# EAGLE design arduino-pro-mini_2-way-switches_v0.2.5_Squeezing (EAGLE 7.2.0)
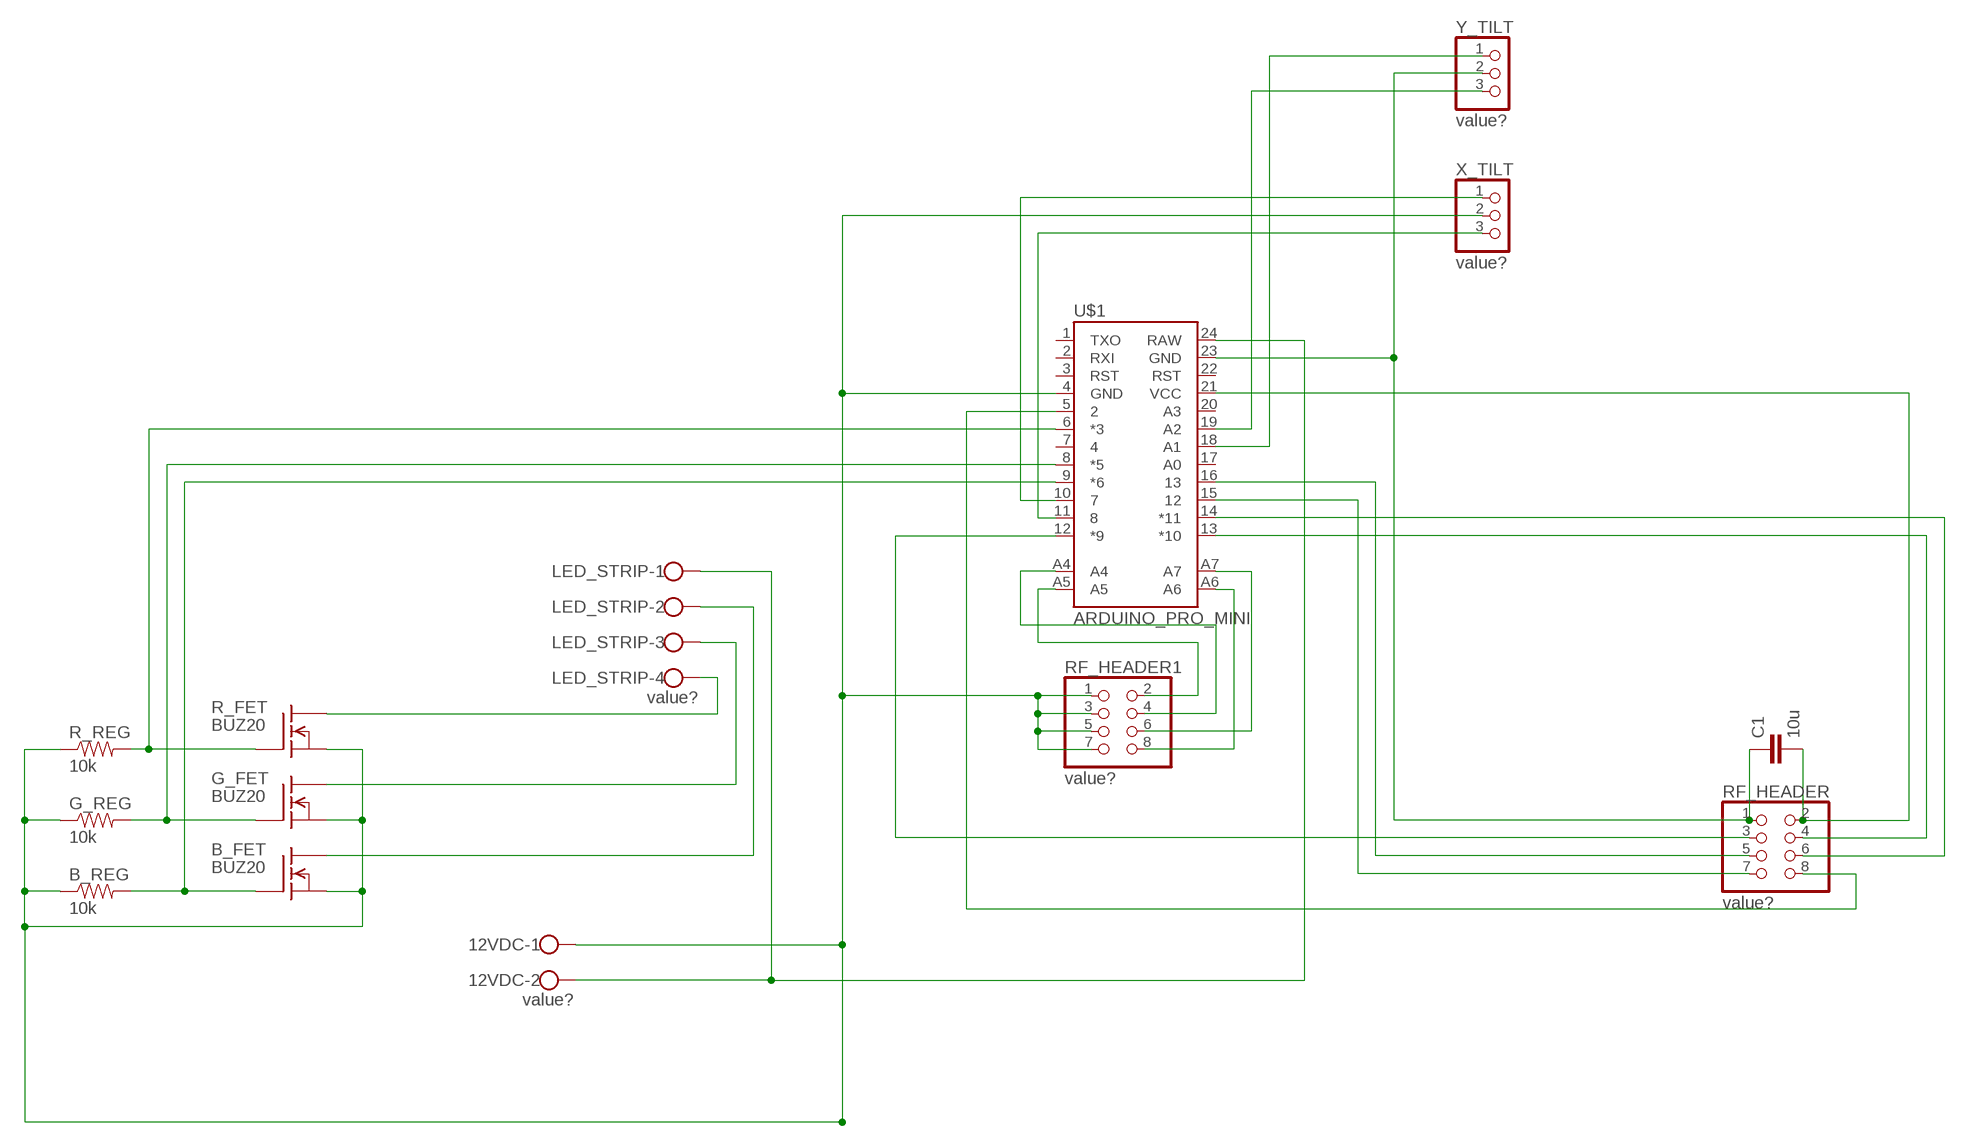
[diagram p0: schematic, sheet 1]

## Parts
12VDC  value?  W237-102  [W237-102]
B_FET  BUZ20  [TO220]
B_REG  10k  RESISTORPTH-1/4W  [AXIAL-0.4]
C1  10u  CAPPTH  [CAP-PTH-SMALL]
G_FET  BUZ20  [TO220]
G_REG  10k  RESISTORPTH-1/4W  [AXIAL-0.4]
LED_STRIP  value?  W237-4  [W237-4]
R_FET  BUZ20  [TO220]
R_REG  10k  RESISTORPTH-1/4W  [AXIAL-0.4]
RF_HEADER  value?  PINHD-2X4  [2X04]
RF_HEADER1  value?  PINHD-2X4  [2X04]
U$1  ARDUINO_PRO_MINI  [ARDUINO_PRO_MINI]
X_TILT  value?  PINHD-1X3  [1X03]
Y_TILT  value?  PINHD-1X3  [1X03]

## Nets
N$1: U$1.10 X_TILT.1
N$2: B_FET.1(G) B_REG.P$2 U$1.9(*6)
N$3: R_FET.1(G) R_REG.P$2 U$1.6(*3)
N$4: G_FET.2(D) LED_STRIP.3
N$5: B_FET.2(D) LED_STRIP.2
N$6: U$1.11 X_TILT.3
N$7: LED_STRIP.4 R_FET.2(D)
N$9: 12VDC.2 LED_STRIP.1 U$1.24(RAW)
N$10: C1.1 RF_HEADER.1 U$1.23(GND) Y_TILT.2
N$11: 12VDC.1 B_FET.3(S) B_REG.P$1 G_FET.3(S) G_REG.P$1 R_FET.3(S) R_REG.P$1 RF_HEADER1.1 RF_HEADER1.3 RF_HEADER1.5 RF_HEADER1.7 U$1.4(GND) X_TILT.2
N$12: RF_HEADER1.4 U$1.A4
N$13: G_FET.1(G) G_REG.P$2 U$1.8(*5)
N$14: U$1.19(A2) Y_TILT.3
N$15: RF_HEADER.3 U$1.12(*9)
N$16: RF_HEADER.4 U$1.13(*10)
N$17: RF_HEADER.6 U$1.14(*11)
N$18: RF_HEADER1.2 U$1.A5
N$19: RF_HEADER1.8 U$1.A6
N$20: RF_HEADER1.6 U$1.A7
N$21: RF_HEADER.7 U$1.15
N$23: RF_HEADER.5 U$1.16
N$25: RF_HEADER.8 U$1.5
N$27: U$1.18(A1) Y_TILT.1
Y_TILT: C1.2 RF_HEADER.2 U$1.21(VCC)
Unconnected: U$1.1(TXO) U$1.2(RXI) U$1.3(RST) U$1.7 U$1.17(A0) U$1.20(A3) U$1.22(RST)

## Library data of the parts
12VDC = con-wago-500:W237-102: WAGO SCREW CLAMP; MPN: 237-102; OC_FARNELL: unknown; OC_NEWARK: 70K9898
B_FET G_FET R_FET = transistor-fet:BUZ20: N-Channel Enhancement MOSFET 100V; 12A; 0,2Ohm
B_REG G_REG R_REG = SparkFun-Passives:RESISTOR: Resistor Basic schematic elements and footprints for 0603, 1206, and PTH resistors.
C1 = SparkFun-Passives:CAP: Capacitor Standard 0603 ceramic capacitor, and 0.1" leaded capacitor.
LED_STRIP = con-wago-500:W237-4: WAGO SCREW CLAMP; OC_FARNELL: unknown; OC_NEWARK: unknown
RF_HEADER RF_HEADER1 = rf-header:PINHD-2X4: PIN HEADER
U$1 = SparkFun-Boards:ARDUINO_PRO_MINI
X_TILT Y_TILT = pinhead:PINHD-1X3: PIN HEADER

## Board
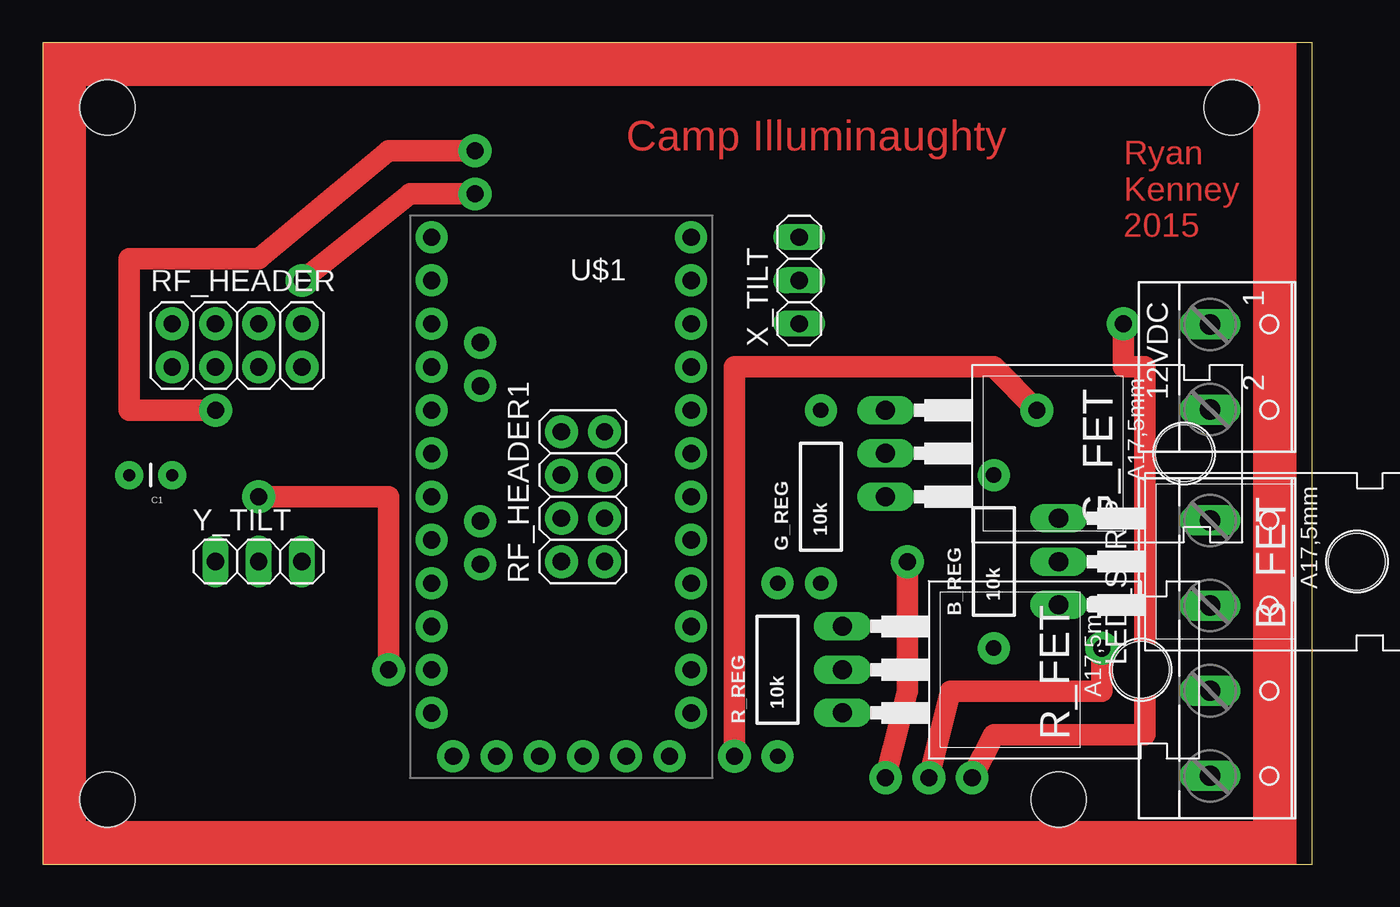
[diagram p1: board, top side]
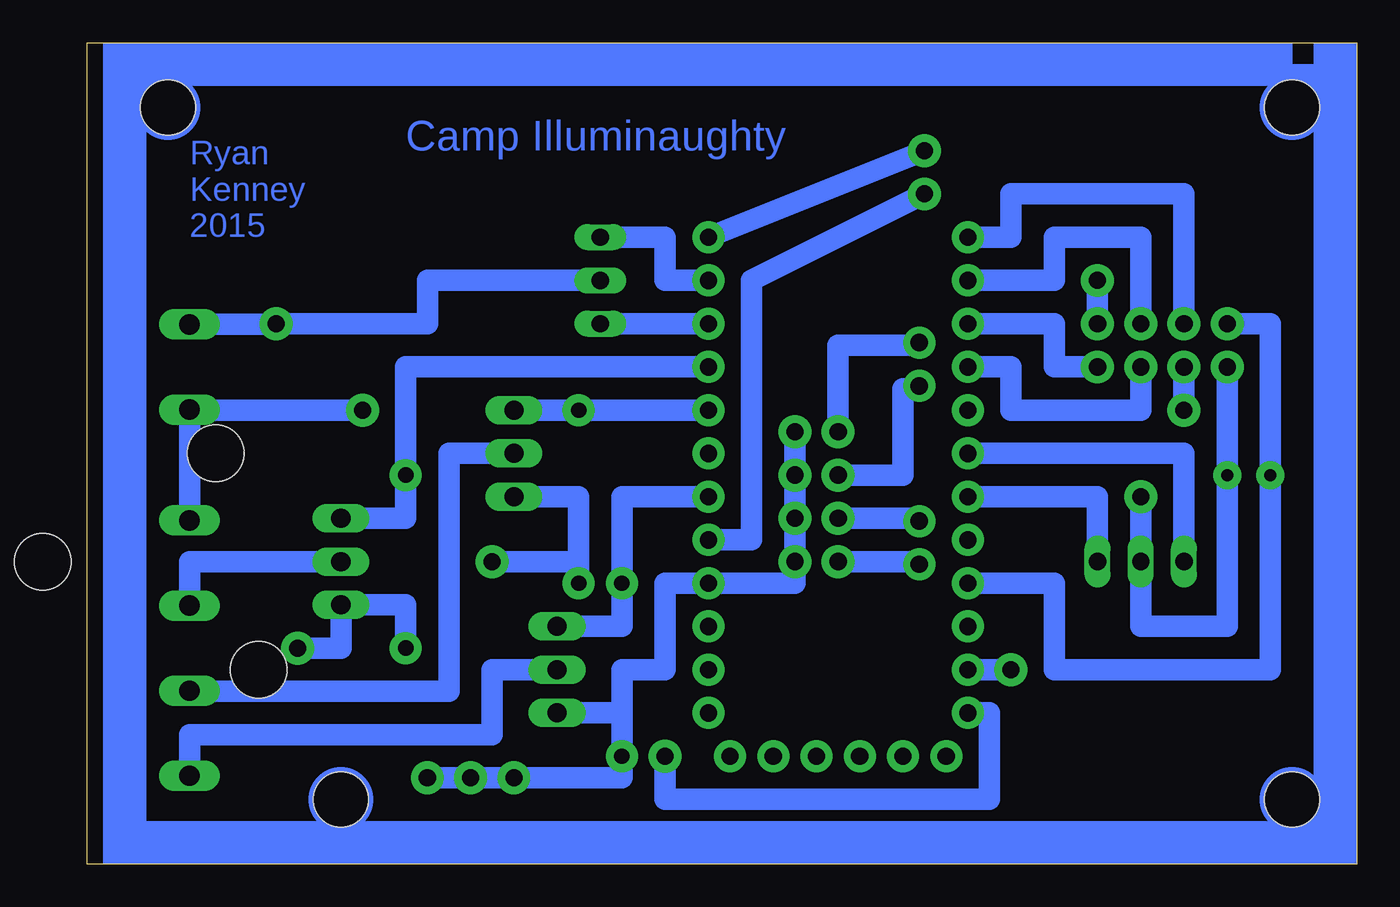
[diagram p2: board, bottom side, seen from below]

Size 74.6 x 48.25 mm. Coordinates in mm from the lower left corner, seen from the top.
Outline: 0,0 74.6,0 74.6,48.25 0,48.25 0,0
Copper layers (1*16): Top 0.035mm / dielectric 1.5mm / Bottom 0.035mm
Design rules "default": minimum track width 10mil, minimum drill 24mil, track to track 8mil, track to pad 8mil, pad to pad 8mil, via to via 8mil, smd to smd 8mil, copper to edge 40mil, drill to drill 8mil, minimum pad ring 10mil, minimum via ring 8mil, stop-mask expansion 4mil, vias tented up to drill 0mil, thermal gap 10mil
Holes 3.2 mm at 3.81,44.45 3.81,3.81 69.85,44.45 59.69,3.81

### Footprints (pad centres in the part's own frame; a part is rotated, then mirrored left to right if it is on the bottom)
W237-102 = drill 1.194 long: 1 -2.5,-1.27; 2 2.5,-1.27
TO220 = drill 1.118 long: 1 -2.54,-6.35; 2 0,-6.35; 3 2.54,-6.35 | hole 3.302: 0,11.176
AXIAL-0.4 = drill 0.9 pad 1.88: P$1 -5.08,0; P$2 5.08,0
CAP-PTH-SMALL = drill 0.7 pad 1.651: 1 0,0; 2 2.54,0
W237-4 = drill 1.194 long: 1 -7.5,-1.27; 2 -2.5,-1.27; 3 2.5,-1.27; 4 7.5,-1.27
2X04 = drill 1.016 pad 1.93: 1 -3.81,-1.27; 2 -3.81,1.27; 3 -1.27,-1.27; 4 -1.27,1.27; 5 1.27,-1.27; 6 1.27,1.27; 7 3.81,-1.27; 8 3.81,1.27
ARDUINO_PRO_MINI = drill 1.016 pad 1.88: 1 -7.62,12.7; 2 -7.62,10.16; 3 -7.62,7.62; 4 -7.62,5.08; 5 -7.62,2.54; 6 -7.62,0; 7 -7.62,-2.54; 8 -7.62,-5.08; 9 -7.62,-7.62; 10 -7.62,-10.16; 11 -7.62,-12.7; 12 -7.62,-15.24; 13 7.62,-15.24; 14 7.62,-12.7; 15 7.62,-10.16; 16 7.62,-7.62; 17 7.62,-5.08; 18 7.62,-2.54; 19 7.62,0; 20 7.62,2.54; 21 7.62,5.08; 22 7.62,7.62; 23 7.62,10.16; 24 7.62,12.7; A4 4.763,1.429; A5 4.763,3.969; A6 4.763,-9.049; A7 4.763,-6.509; BLK -6.35,15.24; GND -3.81,15.24; GRN 6.35,15.24; RXI 1.27,15.24; TXO 3.81,15.24; VCC -1.27,15.24
1X03 = drill 1.016 long: 1 -2.54,0; 2 0,0; 3 2.54,0

### Placement (x,y rotation side)
12VDC  69.85,29.21 270 top
B_FET  66.04,17.78 270 top
B_REG  55.88,17.78 90 top
C1  7.62,22.86 180 top
G_FET  55.88,24.13 270 top
G_REG  45.72,21.59 90 top
LED_STRIP  69.85,12.7 270 top
R_FET  53.34,11.43 270 top
R_REG  43.18,11.43 90 top
RF_HEADER  11.43,30.48 0 top
RF_HEADER1  31.75,21.59 90 top
U$1  30.48,21.59 180 top
X_TILT  44.45,34.29 90 top
Y_TILT  12.7,17.78 0 top

### Tracks (layer width: path | path; a pad name or v marks a point on that pad's centre or on a via)
N$1
  Bottom 1.27: U$1.10 X_TILT.1
N$2
  Bottom 1.27: U$1.9 55.88,29.21 B_REG.P$2 55.88,20.32 B_FET.1
N$3
  Bottom 1.27: U$1.6 43.18,21.59 R_REG.P$2 43.18,13.97 R_FET.1
N$4
  Bottom 1.27: G_FET.2 53.34,24.13 53.34,10.16 68.58,10.16 LED_STRIP.3
N$5
  Bottom 1.27: B_FET.2 68.58,17.78 LED_STRIP.2
N$6
  Bottom 1.27: X_TILT.3 40.64,36.83 40.64,34.29 U$1.11
N$7
  Bottom 1.27: R_FET.2 50.8,11.43 50.8,7.62 68.58,7.62 LED_STRIP.4
N$9  (via drill 1 pad 1.93)
  Top 1.27: v40.64,6.35 40.64,29.21 55.88,29.21 v58.42,26.67
  Bottom 1.27: LED_STRIP.1 12VDC.2 68.58,26.67 v58.42,26.67 | U$1.24 21.59,8.89 21.59,3.81 40.64,3.81 v40.64,6.35
N$10  (via drill 1 pad 1.93)
  Top 1.27: v12.7,21.59 20.32,21.59 v20.32,11.43
  Bottom 1.27: RF_HEADER.1 C1.1 7.62,13.97 12.7,13.97 Y_TILT.2 v12.7,21.59 | v20.32,11.43 U$1.23
N$11  (via drill 1 pad 1.93)
  Top 1.27: v52.07,5.08 53.34,10.16 62.23,10.16 v62.23,12.7 | v50.8,17.78 50.8,10.16 v49.53,5.08 | v63.5,31.75 63.5,29.21 64.77,29.21 64.77,7.62 55.88,7.62 v54.61,5.08
  Bottom 1.27: RF_HEADER1.7 RF_HEADER1.5 RF_HEADER1.3 RF_HEADER1.1 33.02,16.51 U$1.4 40.64,16.51 40.64,11.43 43.18,11.43 43.18,8.89 | 45.72,17.78 45.72,21.59 G_FET.3 | B_REG.P$1 55.88,15.24 B_FET.3 59.69,12.7 v62.23,12.7 | R_FET.3 43.18,8.89 | 43.18,8.89 R_REG.P$1 43.18,5.08 v49.53,5.08 v52.07,5.08 v54.61,5.08 | G_REG.P$1 45.72,17.78 | 45.72,17.78 v50.8,17.78 | 12VDC.1 63.5,31.71 v63.5,31.75 54.61,31.75 54.61,34.29 X_TILT.2
N$12
  Bottom 1.27: RF_HEADER1.4 25.88,20.32 U$1.A4
N$13
  Bottom 1.27: U$1.8 G_REG.P$2 G_FET.1
N$14
  Bottom 1.27: U$1.19 15.24,21.59 Y_TILT.3
N$15  (via drill 1 pad 1.93)
  Top 1.27: v10.16,26.67 5.08,26.67 5.08,35.56 12.7,35.56 20.32,41.91 v25.4,41.91
  Bottom 1.27: RF_HEADER.3 v10.16,26.67 | v25.4,41.91 U$1.12
N$16
  Bottom 1.27: U$1.13 20.32,36.83 20.32,39.37 10.16,39.37 RF_HEADER.4
N$17
  Bottom 1.27: U$1.14 17.78,34.29 17.78,36.83 12.7,36.83 RF_HEADER.6
N$18
  Bottom 1.27: RF_HEADER1.2 25.88,17.78 U$1.A5
N$19
  Bottom 1.27: RF_HEADER1.8 30.48,30.48 25.88,30.48 U$1.A6
N$20
  Bottom 1.27: RF_HEADER1.6 26.67,22.86 26.67,27.94 25.88,27.94 U$1.A7
N$21
  Bottom 1.27: U$1.15 17.78,31.75 17.78,29.21 RF_HEADER.7
N$23
  Bottom 1.27: U$1.16 20.32,29.21 20.32,26.67 12.7,26.67 RF_HEADER.5
N$25  (via drill 1 pad 1.93)
  Top 1.27: v15.24,34.29 21.59,39.37 v25.4,39.37
  Bottom 1.27: RF_HEADER.8 v15.24,34.29 | U$1.5 35.56,19.05 35.56,34.29 v25.4,39.37
N$27
  Bottom 1.27: Y_TILT.1 10.16,24.13 U$1.18
Y_TILT
  Bottom 1.27: U$1.21 17.78,16.51 17.78,11.43 5.08,11.43 C1.2 5.08,31.75 RF_HEADER.2
(copper drawn outside any net)
  shapes: Bottom area x6, Bottom circle x4, Top area x4

### Text on the board
Top: Camp Illuminaughty | Ryan / Kenney / 2015
Bottom: Camp Illuminaughty | Ryan / Kenney / 2015